# EAGLE design April (EAGLE 9.0.1)
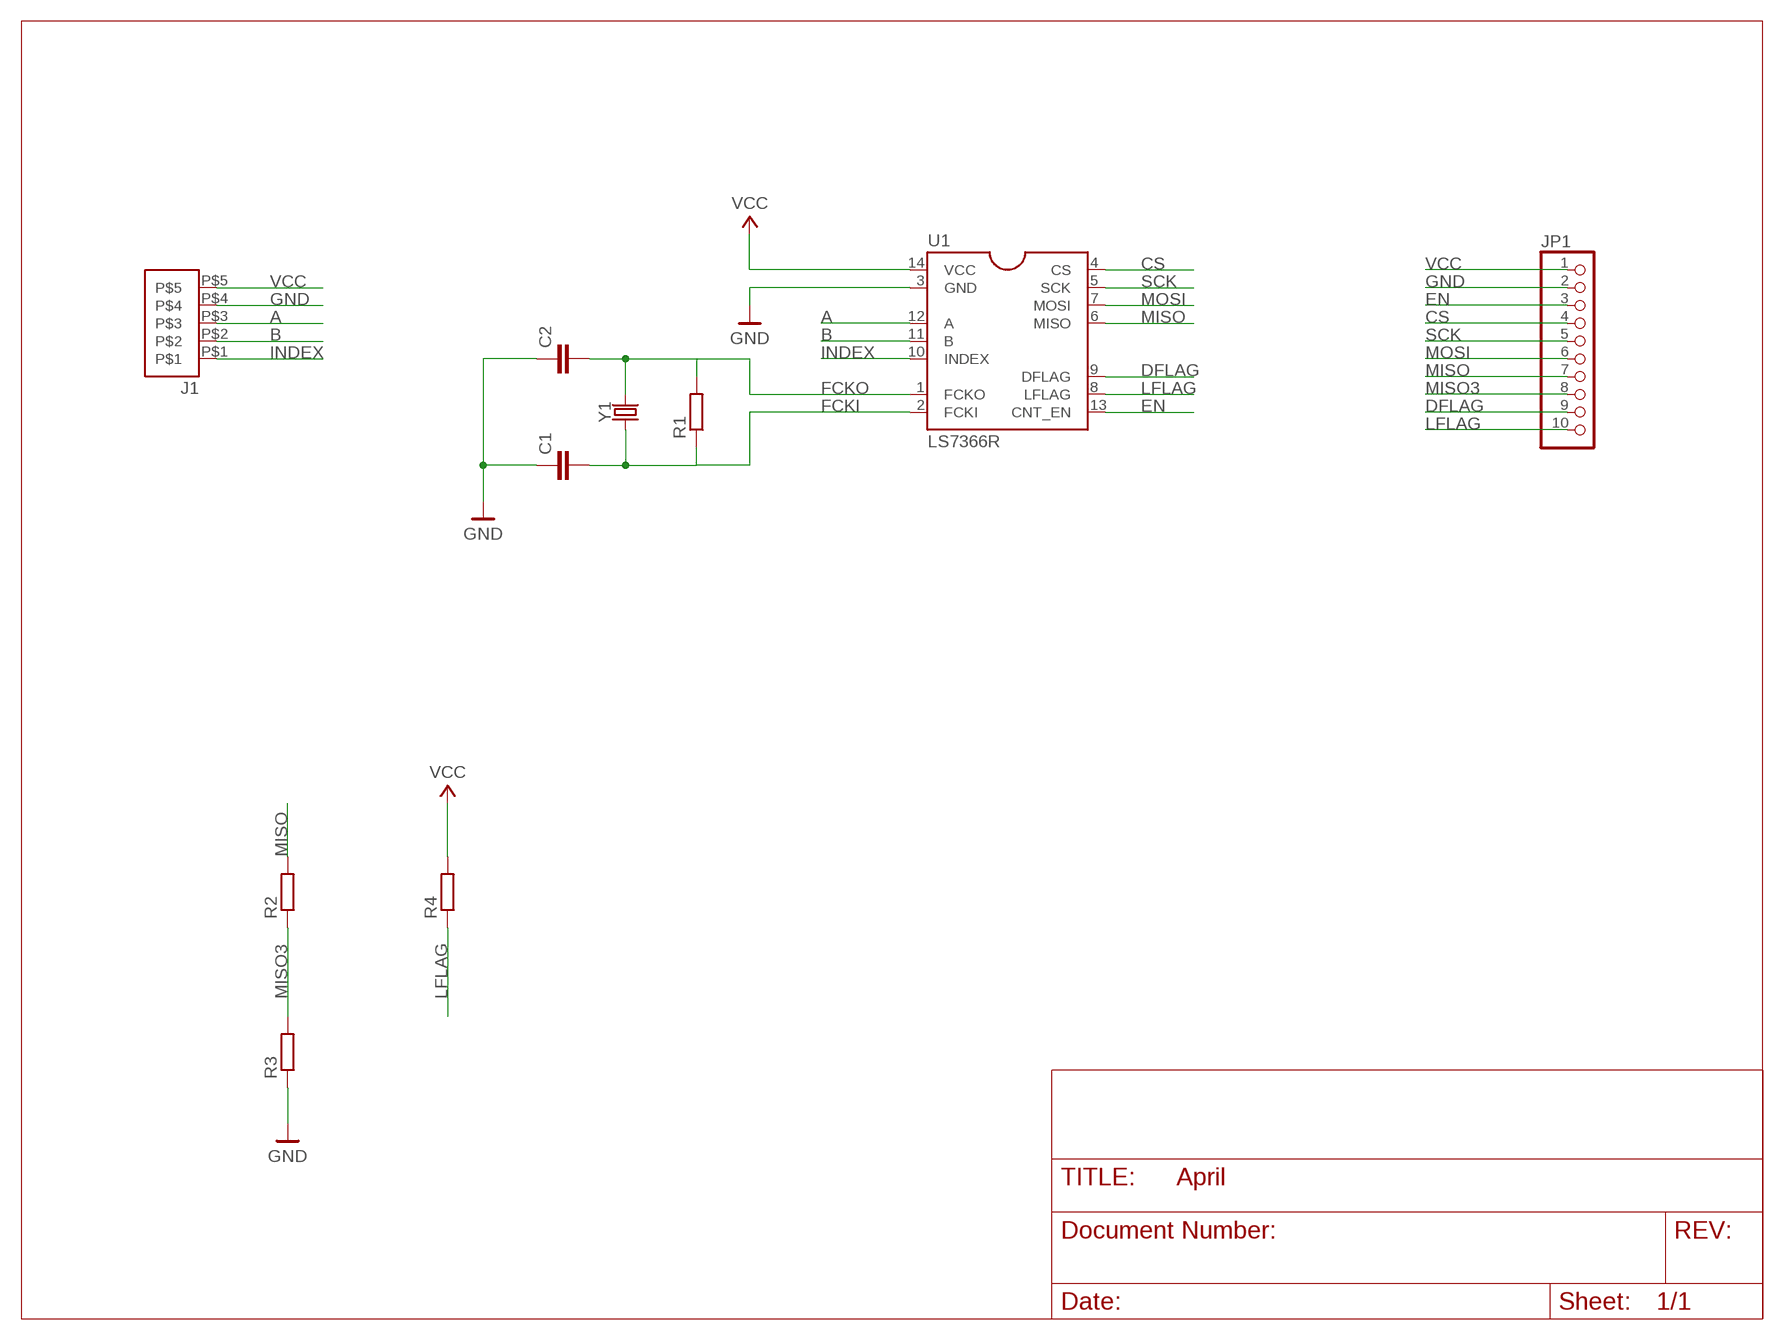
[diagram p0: schematic, sheet 1]

## Parts
C1  C-EU050-024X044  [C050-024X044]
C2  C-EU050-024X044  [C050-024X044]
J1  AF-PID2319  [TB-01-5]
JP1  PINHD-1X10  [1X10]
R1  R-EU_0207/10  [0207/10]
R2  R-EU_0207/10  [0207/10]
R3  R-EU_0207/10  [0207/10]
R4  R-EU_0207/10  [0207/10]
U1  LS7366R  [DIL14]
Y1  CRYSTALPTH-HC49US  [HC49US]

## Nets
A: J1.P$3 U1.12(A)
B: J1.P$2 U1.11(B)
CS: JP1.4 U1.4(CS)
DFLAG: JP1.9 U1.9(DFLAG)
EN: JP1.3 U1.13(CNT_EN)
FCKI: C1.2 R1.1 U1.2(FCKI) Y1.1
FCKO: C2.2 R1.2 U1.1(FCKO) Y1.2
GND: C1.1 C2.1 J1.P$4 JP1.2 R3.1 U1.3(GND)
INDEX: J1.P$1 U1.10(INDEX)
LFLAG: JP1.10 R4.1 U1.8(LFLAG)
MISO: JP1.7 R2.2 U1.6(MISO)
MISO3: JP1.8 R2.1 R3.2
MOSI: JP1.6 U1.7(MOSI)
SCK: JP1.5 U1.5(SCK)
VCC: J1.P$5 JP1.1 R4.2 U1.14(VCC)

## Library data of the parts
C1 C2 = resistor:C-EU: CAPACITOR, European symbol
J1 = Ooo-Connectors:AF-PID2319
JP1 = pinhead:PINHD-1X10: PIN HEADER
R1-R4 = resistor:R-EU_: RESISTOR, European symbol
U1 = Ooo-IC-Specialized:LS7366R: LSI Computer Systems LS7366R 32-BIT QUADRATURE COUNTER WITH SERIAL INTERFACE
Y1 = SparkFun-Clocks:CRYSTAL: Crystals (Generic) These are passive quartz crystals, which can be used as a clock source for a microcontroller. Crystal's are two-terminal devices. They require external "load" capacitors to generate an oscillating signal.

## Board
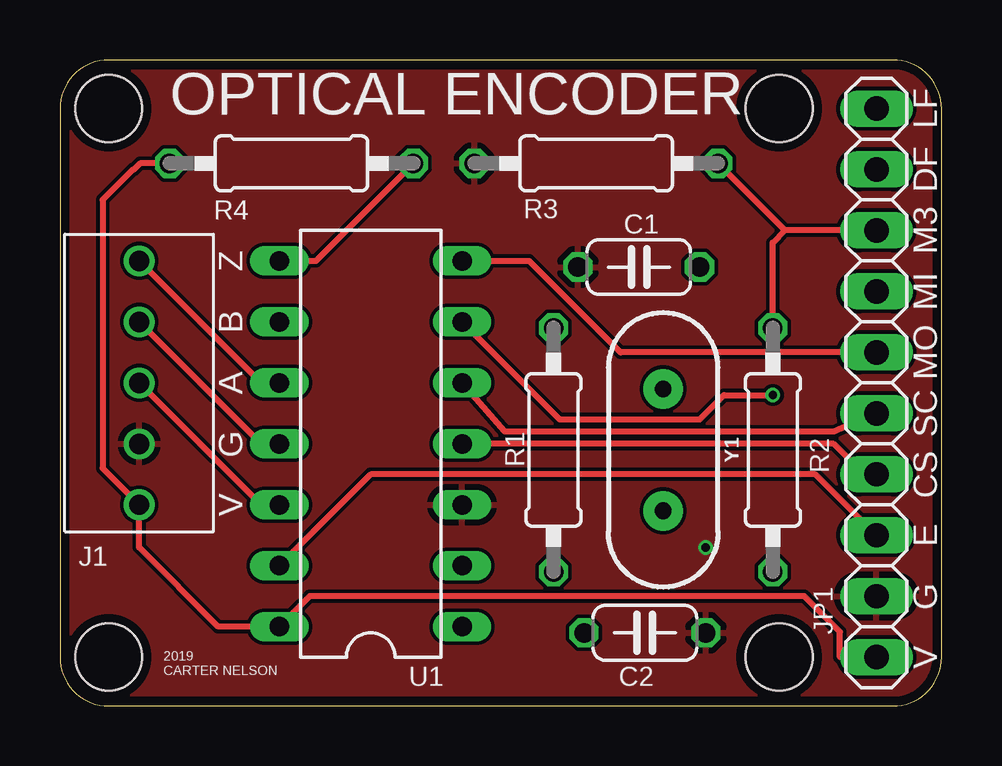
[diagram p1: board, top side]
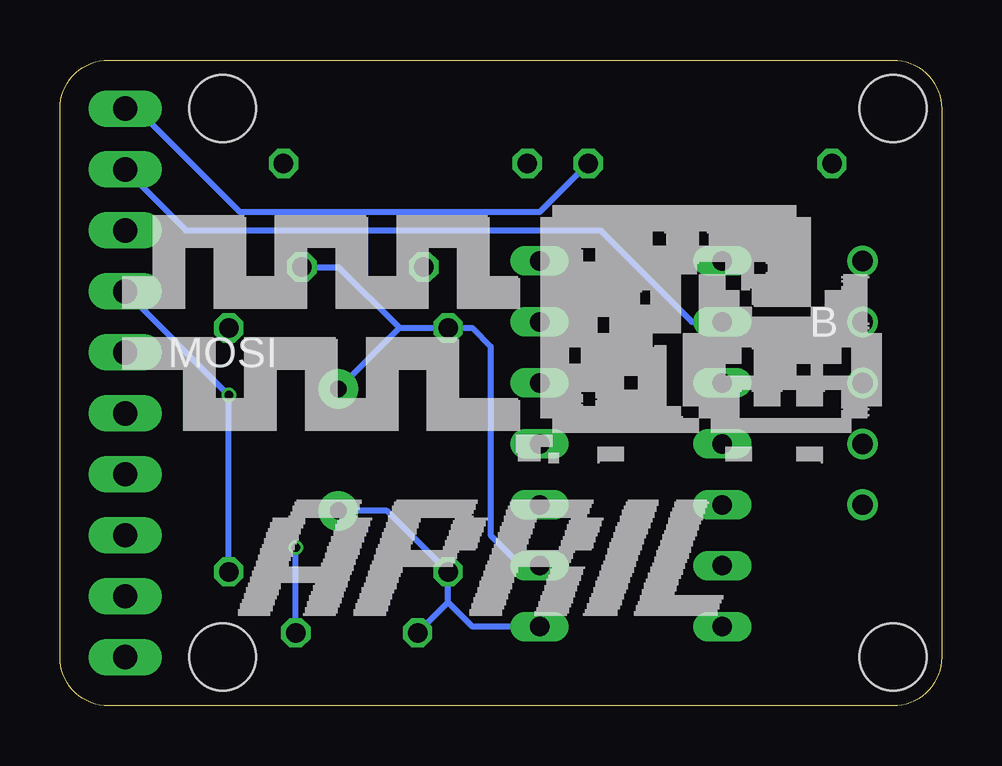
[diagram p2: board, bottom side, seen from below]

Size 36.75 x 26.91 mm. Coordinates in mm from the lower left corner, seen from the top.
Outline: 0,24.88 0,2.03 arc90 2.03,0 34.72,0 arc90 36.75,2.03 36.75,24.88 arc90 34.72,26.91 2.03,26.91 arc90 0,24.88
Copper layers (1*16): Top 0.035559375mm / dielectric 1.6mm / Bottom 0.035559375mm
Design rules "oshpark-2layer": minimum track width 6mil, minimum drill 10mil, track to track 6mil, track to pad 6mil, pad to pad 6mil, via to via 6mil, smd to smd 6mil, copper to edge 15mil, drill to drill 6mil, minimum pad ring 5mil, minimum via ring 5mil, stop-mask expansion 2.5mil, vias tented up to drill 0mil, thermal gap 10mil
Holes 2.79 mm at 2.03,2.03 29.97,2.03 29.97,24.89 2.03,24.89

### Footprints (pad centres in the part's own frame; a part is rotated, then mirrored left to right if it is on the bottom)
C050-024X044 = drill 0.813 octagon: 1 -2.54,0; 2 2.54,0
TB-01-5 = drill 0.85: P$1 0,5.08; P$2 0,2.54; P$3 0,0; P$4 0,-2.54; P$5 0,-5.08
1X10 = drill 1.016 long: 1 -11.43,0; 2 -8.89,0; 3 -6.35,0; 4 -3.81,0; 5 -1.27,0; 6 1.27,0; 7 3.81,0; 8 6.35,0; 9 8.89,0; 10 11.43,0
0207/10 = drill 0.813 octagon: 1 -5.08,0; 2 5.08,0
DIL14 = drill 0.813 long: 1 -7.62,-3.81; 2 -5.08,-3.81; 3 -2.54,-3.81; 4 0,-3.81; 5 2.54,-3.81; 6 5.08,-3.81; 7 7.62,-3.81; 8 7.62,3.81; 9 5.08,3.81; 10 2.54,3.81; 11 0,3.81; 12 -2.54,3.81; 13 -5.08,3.81; 14 -7.62,3.81
HC49US = drill 0.7 pad 1.651: 1 -2.54,0; 2 2.54,0

### Placement (x,y rotation side)
C1  24.13,18.29 0 top
C2  24.38,3.05 180 top
J1  3.3,13.46 0 top
JP1  34.04,13.46 90 top
R1  20.57,10.67 270 top
R2  29.72,10.67 270 top
R3  22.35,22.61 0 top
R4  9.65,22.61 180 top
U1  12.95,10.92 90 top
Y1  25.15,10.67 270 top

### Tracks (layer width: path | path; a pad name or v marks a point on that pad's centre or on a via)
A
  Top 0.254: J1.P$3 8.38,8.38 U1.12
B
  Top 0.254: J1.P$2 8.38,10.92 U1.11
CS
  Top 0.254: JP1.4 33.53,9.65 32.26,10.92 U1.4
DFLAG
  Bottom 0.254: JP1.9 31.5,19.81 14.22,19.81 10.41,16 U1.9
EN
  Top 0.254: JP1.3 31.5,9.65 12.95,9.65 U1.13
FCKI
  Bottom 0.254: Y1.1 22.61,15.75 | 22.61,15.75 R1.1 19.56,15.75 18.8,14.99 18.8,7.11 17.53,5.84 U1.2 | C1.2 25.15,18.29 22.61,15.75
FCKO
  Bottom 0.254: C2.2 20.57,4.32 | 20.57,4.32 R1.2 23.11,8.13 Y1.2 | U1.1 19.56,3.3 20.57,4.32
GND  (via drill 0.35)
  Bottom 0.254: C2.1 v26.92,6.6
  pour Top: 0,0 0,26.92 36.83,26.92 36.83,0
INDEX
  Top 0.254: J1.P$1 8.38,13.46 U1.10
LFLAG
  Top 0.254: U1.8 10.67,18.54 R4.1
  Bottom 0.254: R4.1 16.76,20.57 29.25,20.57 33.56,24.89 JP1.10
MISO  (via drill 0.35)
  Top 0.254: U1.6 20.83,11.94 26.67,11.94 27.69,12.95 v29.72,12.95
  Bottom 0.254: R2.2 v29.72,12.95 JP1.7
MISO3
  Top 0.254: JP1.8 30.23,19.81 | 30.23,19.81 R3.2 | R2.1 29.72,19.3 30.23,19.81
MOSI
  Top 0.254: JP1.6 23.37,14.73 19.56,18.54 U1.7
SCK
  Top 0.254: JP1.5 32.26,11.43 18.54,11.43 U1.5
VCC
  Top 0.254: JP1.1 32.51,2.03 32.51,3.08 31.02,4.57 10.41,4.57 U1.14 6.6,3.3 3.3,6.6 J1.P$5 1.78,9.91 1.78,21.08 3.05,22.35 3.08,22.35 3.34,22.61 R4.2

### Text on the board
tPlace: OPTICAL ENCODER | LF | DF | M3 | Z | MI | B | MO | A | SC | G | CS | V | E | G | V | 2019 / CARTER NELSON
bPlace: B | MOSI